# EAGLE design Own_FeatherWing_Doubler_1X2_v1.0_Final_AR (EAGLE 9.6.2)
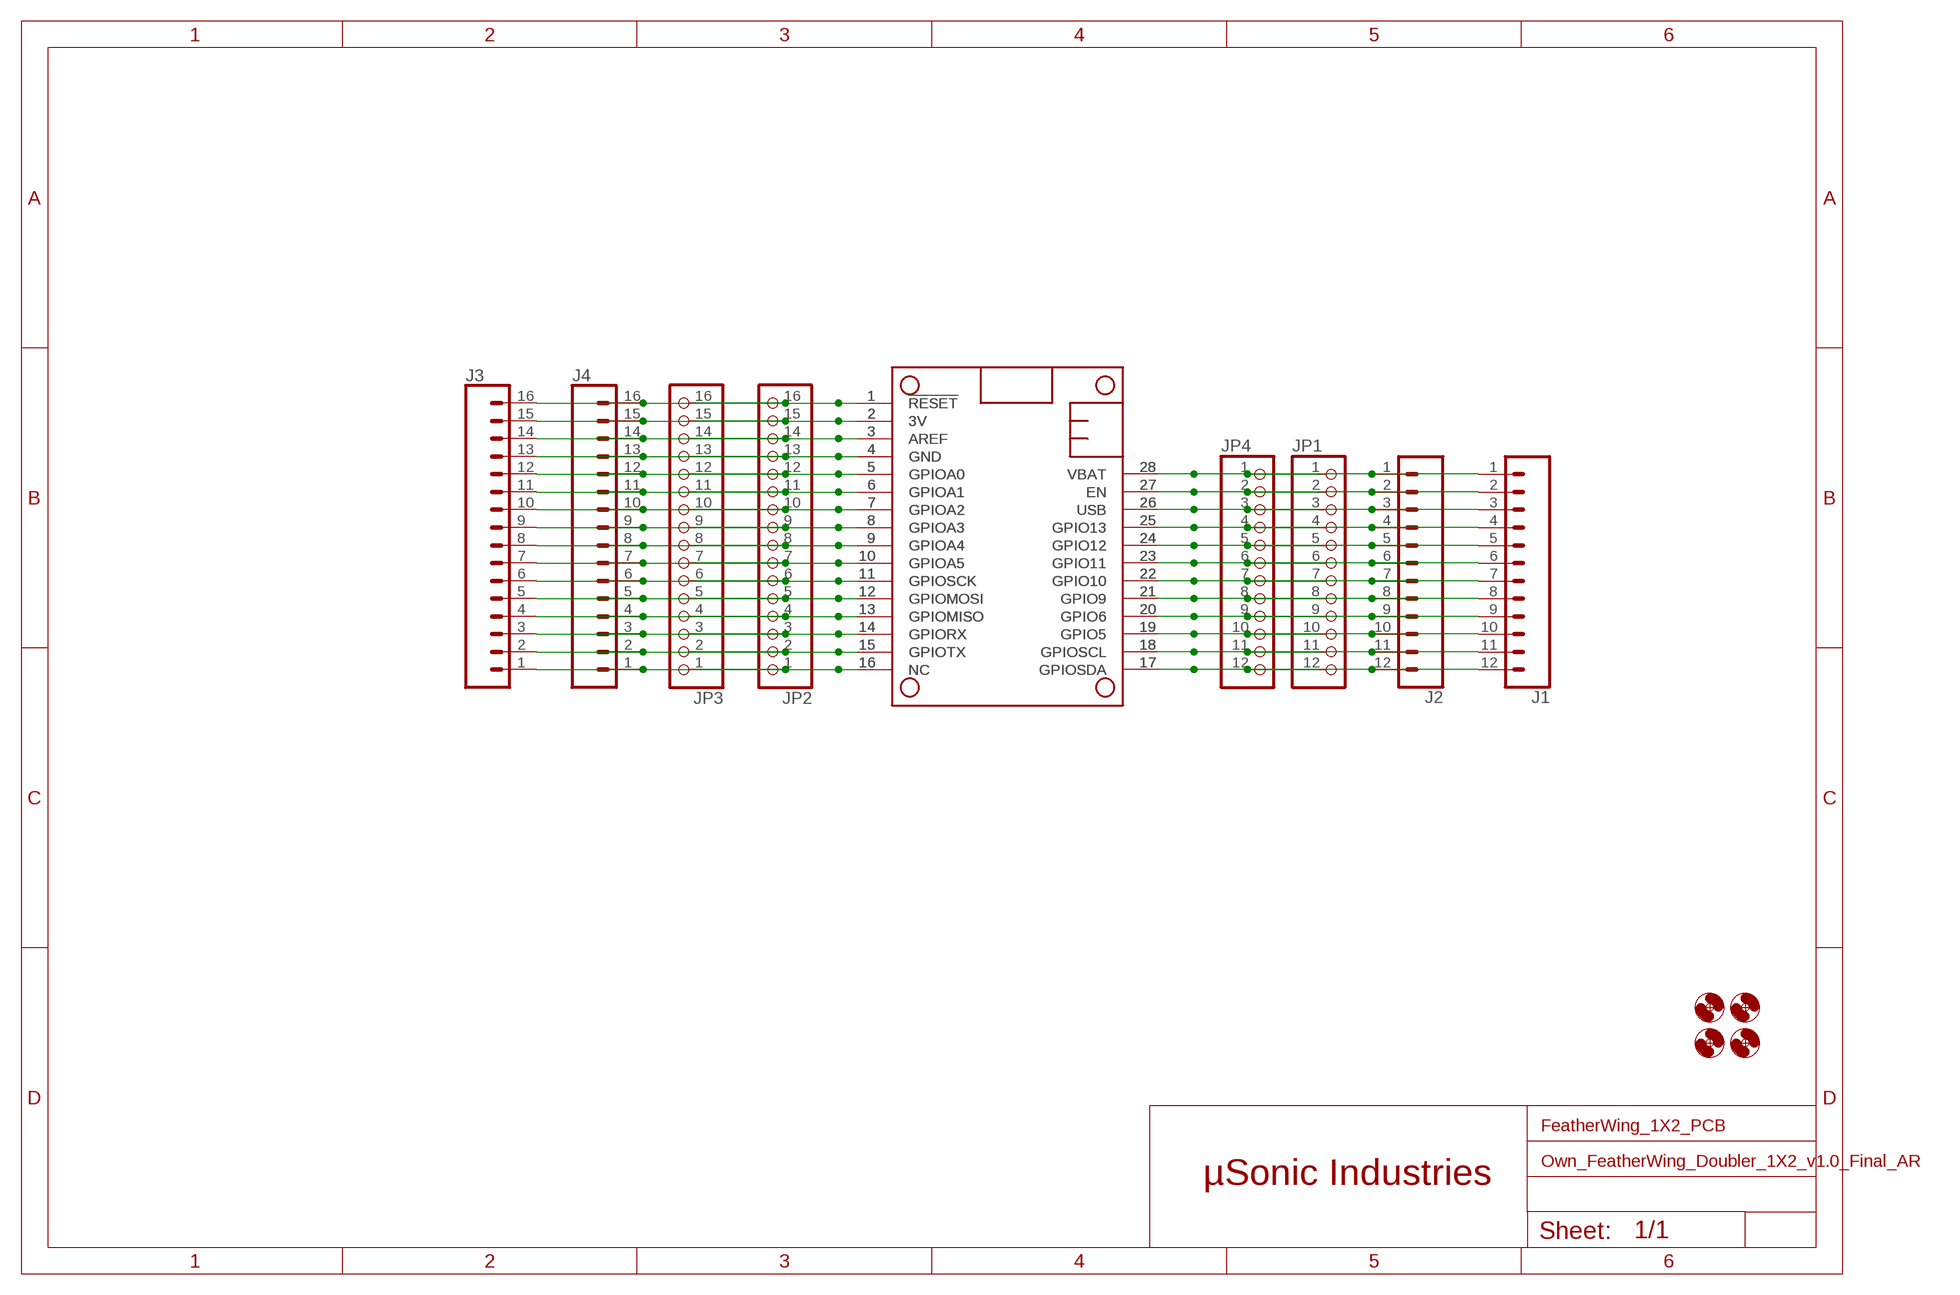
[diagram p0: schematic, sheet 1]

## Parts
J1  CONN_12NO_SILK  [1X12_NO_SILK]
J2  CONN_12NO_SILK  [1X12_NO_SILK]
J3  CONN_161X16_NO_SILK  [1X16_NO_SILK]
J4  CONN_161X16_NO_SILK  [1X16_NO_SILK]
JP1  HEADER-1X1276MIL  [1X12_ROUND_76MIL]
JP2  HEADER-1X16_76MIL  [1X16_ROUND_76MIL]
JP3  HEADER-1X16_76MIL  [1X16_ROUND_76MIL]
JP4  HEADER-1X1276MIL  [1X12_ROUND_76MIL]
MS1  FEATHERWING_NODIM  [FEATHERWING_DIM]
MS2  FEATHERWING_NODIM  [FEATHERWING_DIM]
U$2  MOUNTHOLEBIG  [OWN_MOUNTHOLE_BIGAREA]
U$3  MOUNTHOLEBIG  [OWN_MOUNTHOLE_BIGAREA]
U$4  MOUNTHOLEBIG  [OWN_MOUNTHOLE_BIGAREA]
U$5  MOUNTHOLEBIG  [OWN_MOUNTHOLE_BIGAREA]

## Nets
3V: J3.15 J4.15 JP2.15 JP3.15 MS1.2(3V) MS2.2(3V)
GND: J3.13 J4.13 JP2.13 JP3.13 MS1.4(GND) MS2.4(GND)
N$1: J1.2 J2.2 JP1.2 JP4.2 MS1.27(EN) MS2.27(EN)
N$2: J3.1 J4.1 JP2.1 JP3.1 MS1.16(NC) MS2.16(NC)
N$3: J1.4 J2.4 JP1.4 JP4.4 MS1.25(GPIO13) MS2.25(GPIO13)
N$4: J3.2 J4.2 JP2.2 JP3.2 MS1.15(GPIOTX) MS2.15(GPIOTX)
N$5: J1.5 J2.5 JP1.5 JP4.5 MS1.24(GPIO12) MS2.24(GPIO12)
N$6: J3.3 J4.3 JP2.3 JP3.3 MS1.14(GPIORX) MS2.14(GPIORX)
N$7: J3.4 J4.4 JP2.4 JP3.4 MS1.13(GPIOMISO) MS2.13(GPIOMISO)
N$8: J3.5 J4.5 JP2.5 JP3.5 MS1.12(GPIOMOSI) MS2.12(GPIOMOSI)
N$9: J3.6 J4.6 JP2.6 JP3.6 MS1.11(GPIOSCK) MS2.11(GPIOSCK)
N$10: J3.7 J4.7 JP2.7 JP3.7 MS1.10(GPIOA5) MS2.10(GPIOA5)
N$11: J3.8 J4.8 JP2.8 JP3.8 MS1.9(GPIOA4) MS2.9(GPIOA4)
N$12: J3.9 J4.9 JP2.9 JP3.9 MS1.8(GPIOA3) MS2.8(GPIOA3)
N$13: J3.10 J4.10 JP2.10 JP3.10 MS1.7(GPIOA2) MS2.7(GPIOA2)
N$14: J3.11 J4.11 JP2.11 JP3.11 MS1.6(GPIOA1) MS2.6(GPIOA1)
N$15: J3.12 J4.12 JP2.12 JP3.12 MS1.5(GPIOA0) MS2.5(GPIOA0)
N$17: J3.14 J4.14 JP2.14 JP3.14 MS1.3(AREF) MS2.3(AREF)
N$18: J3.16 J4.16 JP2.16 JP3.16 MS1.1(!RESET) MS2.1(!RESET)
N$19: J1.6 J2.6 JP1.6 JP4.6 MS1.23(GPIO11) MS2.23(GPIO11)
N$20: J1.7 J2.7 JP1.7 JP4.7 MS1.22(GPIO10) MS2.22(GPIO10)
N$21: J1.8 J2.8 JP1.8 JP4.8 MS1.21(GPIO9) MS2.21(GPIO9)
N$22: J1.9 J2.9 JP1.9 JP4.9 MS1.20(GPIO6) MS2.20(GPIO6)
N$23: J1.10 J2.10 JP1.10 JP4.10 MS1.19(GPIO5) MS2.19(GPIO5)
N$24: J1.11 J2.11 JP1.11 JP4.11 MS1.18(GPIOSCL) MS2.18(GPIOSCL)
N$25: J1.12 J2.12 JP1.12 JP4.12 MS1.17(GPIOSDA) MS2.17(GPIOSDA)
USB: J1.3 J2.3 JP1.3 JP4.3 MS1.26(USB) MS2.26(USB)
VBAT: J1.1 J2.1 JP1.1 JP4.1 MS1.28(VBAT) MS2.28(VBAT)

## Notes on the sheet
- FeatherWing_1X2_PCB
- µSonic Industries

## Library data of the parts
J1 J2 = SparkFun-Connectors:CONN_12: Multi connection point. Often used as Generic Header-pin footprint for 0.1 inch spaced/style header connections On any of the 0.1 inch spaced packages, you can populate with these: Break Away Headers - Straight <https://www.sparkfun.com/products/116> (PRT-00116) Break Away Male Headers - Right Angle <https://www.sparkfun.com/products/553> (PRT-00553) Female Headers <https://www.sparkfun.com/products/115> (PRT-00115) Break Away Headers - Machine Pin <https://www.sparkfun.com/products/117> (PRT-00117) Break Away Female Headers - Swiss Machine Pin <https://www.sparkfun.com/products/743> (PRT-00743) For SCREWTERMINALS and SPRING TERMINALS visit here: Screw Terimnals on SparkFun.com <https://www.sparkfun.com/search/results?term=Screw+Terminals> (5mm/3.5mm/2.54mm spacing) This device is also useful as a general connection point to wire up your design to another part of your project. Our various solder wires solder well into these plated through hole pads. Hook-Up Wire - Assortment (Stranded, 22 AWG) <https://www.sparkfun.com/products/11375> (PRT-11375) Hook-Up Wire - Assortment (Solid Core, 22 AWG) <https://www.sparkfun.com/products/11367> (PRT-11367) View the entire wire category on our website here <https://www.sparkfun.com/categories/141> Special notes: Molex polarized connector foot print use with SKU : PRT-08231 with associated crimp pins and housings. 1MM SMD Version SKU: PRT-10208 NOTES ON THE VARIANTS LOCK and LOCK_LONGPADS... This footprint was designed to help hold the alignment of a through-hole component (i.e. 6-pin header) while soldering it into place. You may notice that each hole has been shifted either up or down by 0.005 of an inch from it's more standard position (which is a perfectly straight line). This slight alteration caused the pins (the squares in the middle) to touch the edges of the holes. Because they are alternating, it causes a "brace" to hold the component in place. 0.005 has proven to be the perfect amount of "off-center" position when using our standard breakaway headers. Although looks a little odd when you look at the bare footprint, once you have a header in there, the alteration is very hard to notice. Also,if you push a header all the way into place, it is covered up entirely on the bottom side.
J3 J4 = SparkFun-Connectors:CONN_16: Multi connection point. Often used as Generic Header-pin footprint for 0.1 inch spaced/style header connections On any of the 0.1 inch spaced packages, you can populate with these: Break Away Headers - Straight <https://www.sparkfun.com/products/116> (PRT-00116) Break Away Male Headers - Right Angle <https://www.sparkfun.com/products/553> (PRT-00553) Female Headers <https://www.sparkfun.com/products/115> (PRT-00115) Break Away Headers - Machine Pin <https://www.sparkfun.com/products/117> (PRT-00117) Break Away Female Headers - Swiss Machine Pin <https://www.sparkfun.com/products/743> (PRT-00743) For SCREWTERMINALS and SPRING TERMINALS visit here: Screw Terimnals on SparkFun.com <https://www.sparkfun.com/search/results?term=Screw+Terminals> (5mm/3.5mm/2.54mm spacing) This device is also useful as a general connection point to wire up your design to another part of your project. Our various solder wires solder well into these plated through hole pads. Hook-Up Wire - Assortment (Stranded, 22 AWG) <https://www.sparkfun.com/products/11375> (PRT-11375) Hook-Up Wire - Assortment (Solid Core, 22 AWG) <https://www.sparkfun.com/products/11367> (PRT-11367) View the entire wire category on our website here <https://www.sparkfun.com/categories/141> Special notes: Molex polarized connector foot print use with SKU : PRT-08231 with associated crimp pins and housings. 1MM SMD Version SKU: PRT-10208 NOTES ON THE VARIANTS LOCK and LOCK_LONGPADS... This footprint was designed to help hold the alignment of a through-hole component (i.e. 6-pin header) while soldering it into place. You may notice that each hole has been shifted either up or down by 0.005 of an inch from it's more standard position (which is a perfectly straight line). This slight alteration caused the pins (the squares in the middle) to touch the edges of the holes. Because they are alternating, it causes a "brace" to hold the component in place. 0.005 has proven to be the perfect amount of "off-center" position when using our standard breakaway headers. Although looks a little odd when you look at the bare footprint, once you have a header in there, the alteration is very hard to notice. Also,if you push a header all the way into place, it is covered up entirely on the bottom side.
JP1 JP4 = microbuilder:HEADER-1X12
JP2 JP3 = microbuilder:HEADER-1X16: PIN HEADER
MS1 MS2 = microbuilder:FEATHERWING
U$2-U$5 = adafruit2:MOUNTHOLE

## Net classes
0 default: width 0.25 mm

## Board
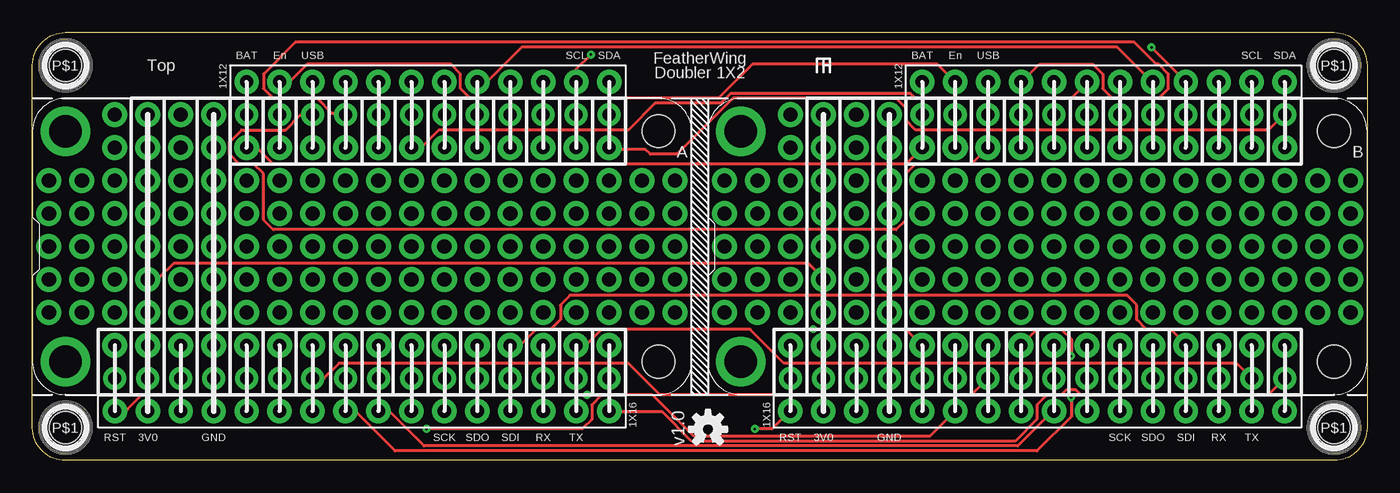
[diagram p1: board, top side]
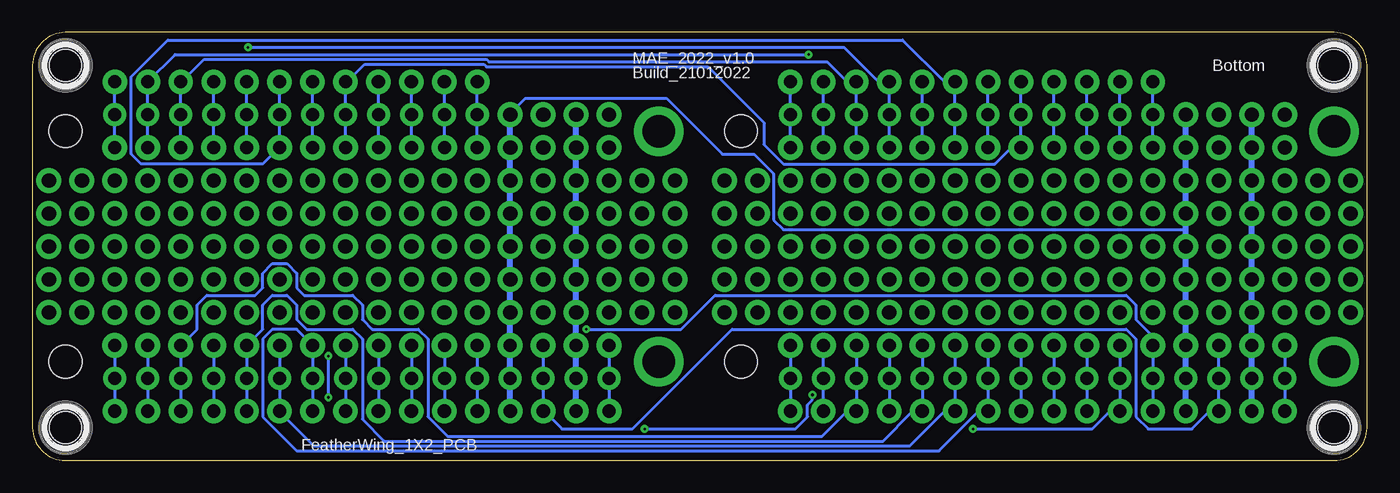
[diagram p2: board, bottom side, seen from below]

Size 102.87 x 33.02 mm. Coordinates in mm from the lower left corner, seen from the top.
Outline: 2.54,33.02 100.33,33.02 arc-90 102.87,30.48 102.87,2.54 arc-90 100.33,0 2.54,0 arc-90 0,2.54 0,30.48 arc-90 2.54,33.02
Copper layers (1*16): Top 0.035mm / dielectric 1.5mm / Bottom 0.035mm
Design rules "aisler_2_layer_complex": minimum track width 0.125mm, minimum drill 0.2mm, track to track 0.125mm, track to pad 0.125mm, pad to pad 0.125mm, via to via 0.125mm, smd to smd 0.125mm, copper to edge 0.3mm, drill to drill 0.25mm, minimum pad ring 0.2mm, minimum via ring 0.2mm, stop-mask expansion 0mil, vias tented up to drill 0mil, thermal gap 10mil

### Footprints (pad centres in the part's own frame; a part is rotated, then mirrored left to right if it is on the bottom)
1X12_NO_SILK = drill 1.016 pad 1.88: 1 0,0; 2 2.54,0; 3 5.08,0; 4 7.62,0; 5 10.16,0; 6 12.7,0; 7 15.24,0; 8 17.78,0; 9 20.32,0; 10 22.86,0; 11 25.4,0; 12 27.94,0
1X16_NO_SILK = drill 1.016 pad 1.88: 1 0,0; 2 2.54,0; 3 5.08,0; 4 7.62,0; 5 10.16,0; 6 12.7,0; 7 15.24,0; 8 17.78,0; 9 20.32,0; 10 22.86,0; 11 25.4,0; 12 27.94,0; 13 30.48,0; 14 33.02,0; 15 35.56,0; 16 38.1,0
1X12_ROUND_76MIL = drill 1 pad 1.93: 1 -13.97,0; 2 -11.43,0; 3 -8.89,0; 4 -6.35,0; 5 -3.81,0; 6 -1.27,0; 7 1.27,0; 8 3.81,0; 9 6.35,0; 10 8.89,0; 11 11.43,0; 12 13.97,0
1X16_ROUND_76MIL = drill 1 pad 1.93: 1 -19.05,0; 2 -16.51,0; 3 -13.97,0; 4 -11.43,0; 5 -8.89,0; 6 -6.35,0; 7 -3.81,0; 8 -1.27,0; 9 1.27,0; 10 3.81,0; 11 6.35,0; 12 8.89,0; 13 11.43,0; 14 13.97,0; 15 16.51,0; 16 19.05,0
FEATHERWING_DIM = drill 1 pad 1.778: 1 6.35,1.27; 2 8.89,1.27; 3 11.43,1.27; 4 13.97,1.27; 5 16.51,1.27; 6 19.05,1.27; 7 21.59,1.27; 8 24.13,1.27; 9 26.67,1.27; 10 29.21,1.27; 11 31.75,1.27; 12 34.29,1.27; 13 36.83,1.27; 14 39.37,1.27; 15 41.91,1.27; 16 44.45,1.27; 17 44.45,21.59; 18 41.91,21.59; 19 39.37,21.59; 20 36.83,21.59; 21 34.29,21.59; 22 31.75,21.59; 23 29.21,21.59; 24 26.67,21.59; 25 24.13,21.59; 26 21.59,21.59; 27 19.05,21.59; 28 16.51,21.59 | drill 2.5 pad 3.81: P$1 2.54,20.32; P$2 2.54,2.54 | hole 2.54: 48.26,20.32; 48.26,2.54
OWN_MOUNTHOLE_BIGAREA = hole 2.5: 0,0

### Placement (x,y rotation side)
J1  16.51,29.21 0 top
J2  68.58,29.21 0 top
J3  96.52,3.81 180 top
J4  44.45,3.81 180 top
JP1  30.48,24.13 0 top
JP2  77.47,8.89 180 top
JP3  25.4,8.89 180 top
JP4  82.55,24.13 0 top
MS1  0,5.08 0 top
MS2  52.07,5.08 0 top
U$2  2.54,30.48 0 top
U$3  100.33,30.48 0 top
U$4  2.54,2.54 0 top
U$5  100.33,2.54 0 top
U$6  [OSHW-LOGO-S]  52.07,2.41 0 top

### Tracks (layer width: path | path; a pad name or v marks a point on that pad's centre or on a via)
3V  (via drill 1.1 pad 1.93)
  Top 0.25: v8.89,13.97 9,14.06 9.75,14.06 10.88,15.19 59.81,15.19 60.94,14.06 v60.96,13.97
  Bottom 0.25: v8.89,11.43 9,11.44 v8.89,11.44 | 8.89,14.06 9,14.06 v8.89,13.97 | v8.89,16.5 9,16.5 v8.89,16.51 | v8.89,19.05 9,19.12 8.89,19.12 | v8.89,21.59 9,21.56 8.89,21.56 | v8.89,24.13 9,24.19 8.89,24.19 | MS1.2 9,6.38 8.89,6.38 | JP3.15 9,8.81 8.89,8.81 | v60.96,11.43 60.94,11.44 v60.96,11.44 | 60.96,14.06 60.94,14.06 v60.96,13.97 | v60.96,16.5 60.94,16.5 v60.96,16.51 | v60.96,19.05 60.94,19.12 60.96,19.12 | v60.96,21.59 60.94,21.56 60.96,21.56 | v60.96,24.13 60.94,24.19 60.96,24.19 | MS2.2 60.94,6.38 60.96,6.38 | JP2.15 60.94,8.81 60.96,8.81
  Bottom 0.45: J3.15 MS2.2 60.96,6.38 60.96,8.81 JP2.15 v60.96,11.43 v60.96,11.44 v60.96,13.97 60.96,14.06 v60.96,16.5 v60.96,16.51 v60.96,19.05 60.96,19.12 60.96,21.56 v60.96,21.59 v60.96,24.13 60.96,24.19 v60.96,26.67 | J4.15 MS1.2 8.89,6.38 8.89,8.81 JP3.15 v8.89,11.43 v8.89,11.44 v8.89,13.97 8.89,14.06 v8.89,16.5 v8.89,16.51 v8.89,19.05 8.89,19.12 8.89,21.56 v8.89,21.59 v8.89,24.13 8.89,24.19 v8.89,26.67
GND  (via drill 1.1 pad 1.93)
  Bottom 0.25: v13.97,11.43 14.06,11.44 v13.97,11.44 | 13.97,14.06 14.06,14.06 v13.97,13.97 | v13.97,16.5 14.06,16.5 v13.97,16.51 | v13.97,19.05 14.06,19.12 13.97,19.12 | v13.97,21.59 14.06,21.56 13.97,21.56 | v13.97,24.13 14.06,24.19 13.97,24.19 | MS1.4 14.06,6.38 13.97,6.38 | JP3.13 14.06,8.81 13.97,8.81 | v66.04,11.43 66.19,11.44 v66.04,11.44 | 66.04,14.06 66.19,14.06 v66.04,13.97 | v66.04,16.5 66.19,16.5 v66.04,16.51 | v66.04,19.05 66.19,19.12 66.04,19.12 | v66.04,21.59 66.19,21.56 66.04,21.56 | v66.04,24.13 66.19,24.19 66.04,24.19 | MS2.4 66,6.38 66.04,6.38 | JP2.13 66.19,8.81 66.04,8.81 | 13.97,17.81 45,17.81 45.75,18.56 45.75,22.12 47.25,23.62 49.69,23.62 54,27.94 64.88,27.94 66,26.81 v66.04,26.67
  Bottom 0.45: J3.13 MS2.4 66.04,6.38 66.04,8.81 JP2.13 v66.04,11.43 v66.04,11.44 v66.04,13.97 66.04,14.06 v66.04,16.5 v66.04,16.51 v66.04,19.05 66.04,19.12 66.04,21.56 v66.04,21.59 v66.04,24.13 66.04,24.19 v66.04,26.67 | J4.13 MS1.4 13.97,6.38 13.97,8.81 JP3.13 v13.97,11.43 v13.97,11.44 v13.97,13.97 13.97,14.06 v13.97,16.5 v13.97,16.51 13.97,17.81 v13.97,19.05 13.97,19.12 13.97,21.56 v13.97,21.59 v13.97,24.13 13.97,24.19 v13.97,26.67
N$1
  Top 0.25: J1.2 19.12,29.25 19.88,29.25 21.19,30.56 32.25,30.56 33,29.81 33,28.69 33.75,27.94 52.88,27.94 55.5,30.56 69.75,30.56 71.06,29.25 J2.2
  Bottom 0.25: JP1.2 MS1.27 | MS1.27 19.05,26.81 | 19.05,26.81 J1.2 | JP4.2 MS2.27 | MS2.27 71.12,26.81 | 71.12,26.81 J2.2 | MS1.27 19.12,26.81 19.05,26.81 | MS2.27 71.06,26.81 71.12,26.81
N$2
  Top 0.25: J4.1 44.62,3.75 48.56,3.75 50.81,1.5 75.75,1.5 77.44,3.19 77.44,4.31 78.19,5.06 79.31,5.06 79.69,5.44 80.44,5.44 80.81,5.06 95.25,5.06 96.38,6.19 MS2.16
  Bottom 0.25: JP3.1 44.45,6.38 | 44.45,6.38 MS1.16 | MS1.16 J4.1 | JP2.1 96.52,6.38 | 96.52,6.38 MS2.16 | MS2.16 J3.1 | MS1.16 44.44,6.38 44.45,6.38 | 96.52,6.38 96.56,6.38 MS2.16
N$3
  Top 0.25: MS1.25 24,26.81 23.06,26.81 21.94,27.94 18.56,27.94 17.81,28.69 17.81,29.81 20.25,32.25 84.94,32.25 86.62,30.56 86.81,30.56 87.56,29.81 87.56,28.69 86.81,27.94 83.25,27.94 82.5,28.69 82.5,29.81 81.75,30.56 77.62,30.56 76.31,29.25 J2.4
  Bottom 0.25: JP1.4 MS1.25 | MS1.25 24.13,26.81 | 24.13,26.81 J1.4 | JP4.4 MS2.25 | MS2.25 76.2,26.81 | 76.2,26.81 J2.4 | MS1.25 24.19,26.81 24.13,26.81 | MS2.25 76.31,26.81 76.2,26.81
N$4
  Top 0.25: JP3.2 42,9 42.75,9 43.88,10.12 55.31,10.12 57.94,7.5 92.81,7.5 93.94,6.38 MS2.15
  Bottom 0.25: J4.2 MS1.15 | MS1.15 41.91,6.38 | 41.91,6.38 JP3.2 | JP2.2 93.98,6.38 | 93.98,6.38 MS2.15 | MS2.15 J3.2 | MS1.15 42,6.38 41.91,6.38 | 93.98,6.38 93.94,6.38 MS2.15
N$5
  Bottom 0.25: MS1.24 JP1.5 26.81,24 27.56,24 28.69,22.88 45,22.88 46.5,24.38 46.5,26.06 50.81,30.38 67.88,30.38 68.06,30.56 77.25,30.56 78.56,29.25 J2.5 78.74,26.81 | MS1.24 26.67,26.81 | 26.67,26.81 J1.5 | JP4.5 MS2.24 | MS2.24 78.74,26.81 | MS1.24 26.62,26.81 26.67,26.81 | MS2.24 78.75,26.81 78.74,26.81
N$6
  Bottom 0.25: JP3.3 39.37,6.38 | 39.37,6.38 MS1.14 | MS1.14 J4.3 39.38,3.75 40.12,3.75 42,1.88 70.88,1.88 72.38,3.38 72.38,9.38 73.12,10.12 76.69,10.12 77.44,10.88 77.44,12 78.19,12.75 81.94,12.75 82.5,13.31 82.5,14.44 83.25,15.19 84.38,15.19 85.12,14.44 85.12,13.31 85.69,12.75 89.44,12.75 90.19,12 90.19,10.12 91.31,9 JP2.3 91.44,6.38 | 91.44,6.38 MS2.14 | MS2.14 J3.3 | MS1.14 39.38,6.38 39.37,6.38 | MS2.14 91.5,6.38 91.44,6.38
N$7
  Top 0.25: JP3.4 36.94,9 37.69,9 38.81,10.12 39.94,10.12 40.69,10.88 40.69,12 41.44,12.75 84.38,12.75 85.12,12 85.12,10.88 85.88,10.12 87.75,10.12 88.88,9 JP2.4
  Bottom 0.25: JP3.4 36.83,6.38 | 36.83,6.38 MS1.13 | MS1.13 J4.4 | JP2.4 88.9,6.38 | 88.9,6.38 MS2.13 | MS2.13 J3.4 | MS1.13 36.94,6.38 36.83,6.38 | MS2.13 88.88,6.38 88.9,6.38
N$8
  Bottom 0.25: JP3.5 34.29,6.38 | 34.29,6.38 MS1.12 | MS1.12 J4.5 34.31,3.75 35.06,3.75 37.31,1.5 75.75,1.5 77.44,3.19 77.44,9.38 78.19,10.12 81.75,10.12 82.5,10.88 82.5,12 83.25,12.75 84.38,12.75 85.12,12 85.12,10.12 JP2.5 86.36,6.38 | 86.36,6.38 MS2.12 | MS2.12 J3.5 | MS1.12 34.31,6.38 34.29,6.38 | MS2.12 86.44,6.38 86.36,6.38
N$9
  Bottom 0.25: JP3.6 31.75,6.38 | 31.75,6.38 MS1.11 | MS1.11 J4.6 31.88,3.75 32.62,3.75 35.25,1.12 81.19,1.12 83.81,3.75 J3.6 MS2.11 | JP2.6 83.82,6.38 | 83.82,6.38 MS2.11 | MS1.11 31.69,6.38 31.75,6.38 | MS2.11 83.81,6.38 83.82,6.38
N$10
  Bottom 0.25: JP3.7 29.21,6.38 | 29.21,6.38 MS1.10 | MS1.10 J4.7 29.25,3.75 30,3.75 33,0.75 82.5,0.75 85.12,3.38 85.12,9.38 84.38,10.12 82.5,10.12 81.38,9 JP2.7 81.28,6.38 | 81.28,6.38 MS2.10 | MS2.10 J3.7 | MS1.10 29.25,6.38 29.21,6.38 | MS2.10 81.38,6.38 81.28,6.38
N$11
  Top 0.25: J4.8 26.81,3.75 27.56,3.75 30.19,1.12 75.94,1.12 78.56,3.75 J3.8
  Bottom 0.25: JP3.8 26.67,6.38 | 26.67,6.38 MS1.9 | MS1.9 J4.8 | JP2.8 78.74,6.38 | 78.74,6.38 MS2.9 | MS2.9 J3.8 | MS1.9 26.62,6.38 26.67,6.38 | MS2.9 78.75,6.38 78.74,6.38
N$12  (via drill 0.2)
  Top 0.25: v80.06,4.88 80.06,3.38 77.44,0.75 27.94,0.75 24.94,3.75 24.19,3.75 J4.9 | v80.06,8.06 80.06,9.38 79.31,10.12 77.44,10.12 76.31,9 JP2.9
  Bottom 0.25: JP3.9 24.13,6.38 | 24.13,6.38 MS1.8 | MS1.8 J4.9 | JP2.9 76.2,6.38 | 76.2,6.38 MS2.8 | MS2.8 J3.9 | MS1.8 24.19,6.38 24.13,6.38 | v80.06,8.06 v80.06,4.88 | MS2.8 76.31,6.38 76.2,6.38
N$13
  Top 0.25: MS1.7 21.75,6.38 22.5,6.38 23.62,7.5 45.94,7.5 48.38,5.06 72.38,5.06 73.5,6.19 MS2.7
  Bottom 0.25: JP3.10 21.59,6.38 | 21.59,6.38 MS1.7 | MS1.7 J4.10 | JP2.10 73.66,6.38 | 73.66,6.38 MS2.7 | MS2.7 J3.10 | MS1.7 21.56,6.38 21.59,6.38 | 73.66,6.38 73.69,6.38 MS2.7
N$14  (via drill 0.2)
  Top 0.25: v30.38,2.44 42.38,2.44 43.12,3.19 43.12,4.31 43.88,5.06 47.81,5.06 51,1.88 69.19,1.88 71.06,3.75 J3.11
  Bottom 0.25: JP3.11 19.05,6.38 | 19.05,6.38 MS1.6 | MS1.6 J4.11 19.12,3.75 19.88,3.75 21.19,2.44 v30.38,2.44 | JP2.11 71.12,6.38 | 71.12,6.38 MS2.6 | MS2.6 J3.11 | MS1.6 19.12,6.38 19.05,6.38 | MS2.6 71.06,6.38 71.12,6.38
N$15  (via drill 0.2)
  Top 0.25: v60.19,10.12 67.31,10.12 68.44,9 JP2.12
  Bottom 0.25: 16.51,6.38 JP3.12 16.69,9 16.69,9.75 17.81,10.88 17.81,12 18.56,12.75 50.25,12.75 52.88,10.12 v60.19,10.12 | 16.51,6.38 MS1.5 | MS1.5 J4.12 | JP2.12 68.58,6.38 | 68.58,6.38 MS2.5 | MS2.5 J3.12 | MS1.5 16.5,6.38 16.51,6.38 | MS2.5 68.62,6.38 68.58,6.38
N$16  (via drill 1.1 pad 1.93)
  other vias: 96.52,11.43
N$17
  Bottom 0.25: JP2.14 63.5,6.38 | 63.5,6.38 MS2.3 | MS2.3 J3.14 63.38,3.75 62.06,2.44 56.62,2.44 48.94,10.12 18.56,10.12 17.81,9.38 17.81,3.38 16.88,2.44 13.5,2.44 12.19,3.75 11.44,3.75 J4.14 MS1.3 | MS1.3 11.43,6.38 | 11.43,6.38 JP3.14 | MS1.3 11.44,6.38 11.43,6.38 | MS2.3 63.56,6.38 63.5,6.38
N$18  (via drill 0.2)
  Top 0.25: v42.75,5.06 8.44,5.06 7.31,3.94 6.38,3.94 J4.16 | v55.69,2.44 57,2.44 58.31,3.75 J3.16
  Bottom 0.25: JP3.16 6.35,6.38 | 6.35,6.38 MS1.1 | MS1.1 J4.16 | JP2.16 58.42,6.38 | 58.42,6.38 MS2.1 | MS2.1 J3.16 | MS1.1 6.38,6.38 6.35,6.38 | v42.75,5.06 42.75,4.69 43.12,4.31 43.12,3.38 44.06,2.44 v55.69,2.44 | MS2.1 58.5,6.38 58.42,6.38
N$19
  Top 0.25: JP1.6 29.25,24.19 30,24.19 31.31,25.5 45.94,25.5 48,27.56 53.06,27.56 53.81,28.31 67.69,28.31 68.06,27.94 80.06,27.94 81.19,29.06 J2.6
  Bottom 0.25: JP1.6 MS1.23 | MS1.23 29.21,26.81 | 29.21,26.81 J1.6 | JP4.6 MS2.23 | MS2.23 81.28,26.81 | 81.28,26.81 J2.6 | MS1.23 29.25,26.81 29.21,26.81 | MS2.23 81.38,26.81 81.28,26.81
N$20
  Bottom 0.25: JP1.7 MS1.22 | MS1.22 31.75,26.81 | 31.75,26.81 J1.7 31.88,29.25 32.62,29.25 35.81,32.44 92.44,32.44 95.25,29.62 95.25,23.62 94.5,22.88 85.12,22.88 84,24 JP4.7 MS2.22 | MS2.22 83.82,26.81 | 83.82,26.81 J2.7 | MS1.22 31.69,26.81 31.75,26.81 | MS2.22 83.81,26.81 83.82,26.81
N$21
  Top 0.25: J1.8 34.31,29.25 35.06,29.25 37.69,31.88 83.62,31.88 86.25,29.25 J2.8
  Bottom 0.25: JP1.8 MS1.21 | MS1.21 34.29,26.81 | 34.29,26.81 J1.8 | JP4.8 MS2.21 | MS2.21 86.36,26.81 | 86.36,26.81 J2.8 | MS1.21 34.31,26.81 34.29,26.81 | MS2.21 86.44,26.81 86.36,26.81
N$22  (via drill 0.2)
  Top 0.25: v86.25,31.88 88.88,29.25 J2.9
  Bottom 0.25: JP1.9 MS1.20 | MS1.20 36.83,26.81 | 36.83,26.81 J1.9 36.94,29.25 37.69,29.25 40.31,31.88 v86.25,31.88 | JP4.9 MS2.20 | MS2.20 88.9,26.81 | 88.9,26.81 J2.9 | MS1.20 36.94,26.81 36.83,26.81 | MS2.20 88.88,26.81 88.9,26.81
N$23
  Bottom 0.25: JP1.10 MS1.19 | MS1.19 39.37,26.81 | 39.37,26.81 J1.10 39.38,29.25 40.12,29.25 41.62,30.75 67.69,30.75 67.88,30.94 89.62,30.94 91.31,29.25 J2.10 91.44,26.81 | JP4.10 MS2.19 | MS2.19 91.44,26.81 | MS1.19 39.38,26.81 39.37,26.81 | MS2.19 91.5,26.81 91.44,26.81
N$24  (via drill 0.2)
  Top 0.25: J1.11 41.91,30.18 v43.05,31.31
  Bottom 0.25: JP1.11 MS1.18 | MS1.18 41.91,26.81 | 41.91,26.81 J1.11 | JP4.11 MS2.18 | MS2.18 93.98,26.81 | 93.98,26.81 J2.11 93.94,29.25 91.88,31.31 v43.05,31.31 | MS1.18 42,26.81 41.91,26.81 | MS2.18 93.94,26.81 93.98,26.81
N$25
  Top 0.25: JP1.12 44.62,24 47.25,24 47.62,23.62 49.69,23.62 54,27.94 66.56,27.94 67.31,27.19 67.31,26.25 68.06,25.5 95.25,25.5 96.38,26.62 MS2.17
  Bottom 0.25: JP1.12 MS1.17 | MS1.17 44.45,26.81 | 44.45,26.81 J1.12 | JP4.12 96.52,26.62 | 96.52,26.62 MS2.17 | MS2.17 J2.12 | MS1.17 44.44,26.81 44.45,26.81 | 96.52,26.62 96.56,26.62 MS2.17
N$26  (via drill 1.1 pad 1.93)
  other vias: 6.35,11.43
N$27  (via drill 1.1 pad 1.93)
  other vias: 96.52,13.97
N$28  (via drill 1.1 pad 1.93)
  other vias: 11.43,11.43
N$29  (via drill 1.1 pad 1.93)
  other vias: 96.52,16.51
N$30  (via drill 1.1 pad 1.93)
  other vias: 96.52,19.05
N$31  (via drill 1.1 pad 1.93)
  other vias: 11.43,13.97
N$32  (via drill 1.1 pad 1.93)
  other vias: 96.52,21.59
N$33  (via drill 1.1 pad 1.93)
  other vias: 6.35,13.97
N$34  (via drill 1.1 pad 1.93)
  other vias: 6.35,16.51
N$35  (via drill 1.1 pad 1.93)
  other vias: 93.98,21.59
N$36  (via drill 1.1 pad 1.93)
  other vias: 3.81,11.43
N$37  (via drill 1.1 pad 1.93)
  other vias: 1.27,11.43
N$38  (via drill 1.1 pad 1.93)
  other vias: 1.27,13.97
N$39  (via drill 1.1 pad 1.93)
  other vias: 3.81,13.97
N$40  (via drill 1.1 pad 1.93)
  other vias: 3.81,16.51
N$41  (via drill 1.1 pad 1.93)
  other vias: 1.27,16.51
N$42  (via drill 1.1 pad 1.93)
  other vias: 1.27,19.05
N$43  (via drill 1.1 pad 1.93)
  other vias: 3.81,19.05
N$44  (via drill 1.1 pad 1.93)
  other vias: 6.35,19.05
N$45  (via drill 1.1 pad 1.93)
  other vias: 93.98,19.05
N$46  (via drill 1.1 pad 1.93)
  other vias: 11.43,19.05
N$47  (via drill 1.1 pad 1.93)
  other vias: 11.43,16.51
N$48  (via drill 1.1 pad 1.93)
  other vias: 93.98,16.51
N$49  (via drill 1.1 pad 1.93)
  other vias: 93.98,13.97
N$50  (via drill 1.1 pad 1.93)
  other vias: 1.27,21.59
N$51  (via drill 1.1 pad 1.93)
  other vias: 3.81,21.59
N$52  (via drill 1.1 pad 1.93)
  other vias: 6.35,21.59
N$53  (via drill 1.1 pad 1.93)
  other vias: 93.98,11.43
N$54  (via drill 1.1 pad 1.93)
  other vias: 11.43,21.59
N$55  (via drill 1.1 pad 1.93)
  other vias: 99.06,11.43
N$56  (via drill 1.1 pad 1.93)
  other vias: 99.06,13.97
N$57  (via drill 1.1 pad 1.93)
  other vias: 99.06,16.51
N$58  (via drill 1.1 pad 1.93)
  other vias: 11.43,26.67
N$59  (via drill 1.1 pad 1.93)
  other vias: 11.43,24.13
N$60  (via drill 1.1 pad 1.93)
  other vias: 99.06,19.05
N$61  (via drill 1.1 pad 1.93)
  other vias: 99.06,21.59
N$62  (via drill 1.1 pad 1.93)
  other vias: 6.35,26.67
N$63  (via drill 1.1 pad 1.93)
  other vias: 6.35,24.13
N$64  (via drill 1.1 pad 1.93)
  other vias: 16.51,11.43
N$65  (via drill 1.1 pad 1.93)
  other vias: 16.51,13.97
N$66  (via drill 1.1 pad 1.93)
  other vias: 16.51,16.51
N$67  (via drill 1.1 pad 1.93)
  other vias: 16.51,19.05
N$68  (via drill 1.1 pad 1.93)
  other vias: 16.51,21.59
N$69  (via drill 1.1 pad 1.93)
  other vias: 19.05,21.59
N$70  (via drill 1.1 pad 1.93)
  other vias: 19.05,19.05
N$71  (via drill 1.1 pad 1.93)
  other vias: 19.05,16.51
N$72  (via drill 1.1 pad 1.93)
  other vias: 19.05,13.97
N$73  (via drill 1.1 pad 1.93)
  other vias: 19.05,11.43
N$74  (via drill 1.1 pad 1.93)
  other vias: 21.59,11.43
N$75  (via drill 1.1 pad 1.93)
  other vias: 21.59,13.97
N$76  (via drill 1.1 pad 1.93)
  other vias: 21.59,16.51
N$77  (via drill 1.1 pad 1.93)
  other vias: 21.59,19.05
N$78  (via drill 1.1 pad 1.93)
  other vias: 21.59,21.59
N$79  (via drill 1.1 pad 1.93)
  other vias: 24.13,21.59
N$80  (via drill 1.1 pad 1.93)
  other vias: 24.13,19.05
N$81  (via drill 1.1 pad 1.93)
  other vias: 24.13,16.51
N$82  (via drill 1.1 pad 1.93)
  other vias: 24.13,13.97
N$83  (via drill 1.1 pad 1.93)
  other vias: 24.13,11.43
N$84  (via drill 1.1 pad 1.93)
  other vias: 26.67,11.43
N$85  (via drill 1.1 pad 1.93)
  other vias: 26.67,13.97
N$86  (via drill 1.1 pad 1.93)
  other vias: 26.67,16.51
N$87  (via drill 1.1 pad 1.93)
  other vias: 26.67,19.05
N$88  (via drill 1.1 pad 1.93)
  other vias: 26.67,21.59
N$89  (via drill 1.1 pad 1.93)
  other vias: 29.21,21.59
N$90  (via drill 1.1 pad 1.93)
  other vias: 29.21,19.05
N$91  (via drill 1.1 pad 1.93)
  other vias: 29.21,16.51
N$92  (via drill 1.1 pad 1.93)
  other vias: 29.21,13.97
N$93  (via drill 1.1 pad 1.93)
  other vias: 29.21,11.43
N$94  (via drill 1.1 pad 1.93)
  other vias: 31.75,11.43
N$95  (via drill 1.1 pad 1.93)
  other vias: 34.29,11.43
N$96  (via drill 1.1 pad 1.93)
  other vias: 36.83,11.43
N$97  (via drill 1.1 pad 1.93)
  other vias: 39.37,11.43
N$98  (via drill 1.1 pad 1.93)
  other vias: 41.91,11.43
N$99  (via drill 1.1 pad 1.93)
  other vias: 41.91,13.97
N$100  (via drill 1.1 pad 1.93)
  other vias: 41.91,16.51
N$101  (via drill 1.1 pad 1.93)
  other vias: 41.91,19.05
N$102  (via drill 1.1 pad 1.93)
  other vias: 41.91,21.59
N$103  (via drill 1.1 pad 1.93)
  other vias: 39.37,21.59
N$104  (via drill 1.1 pad 1.93)
  other vias: 39.37,19.05
N$105  (via drill 1.1 pad 1.93)
  other vias: 39.37,16.51
N$106  (via drill 1.1 pad 1.93)
  other vias: 39.37,13.97
N$107  (via drill 1.1 pad 1.93)
  other vias: 36.83,13.97
N$108  (via drill 1.1 pad 1.93)
  other vias: 36.83,16.51
N$109  (via drill 1.1 pad 1.93)
  other vias: 36.83,19.05
N$110  (via drill 1.1 pad 1.93)
  other vias: 36.83,21.59
N$111  (via drill 1.1 pad 1.93)
  other vias: 34.29,21.59
N$112  (via drill 1.1 pad 1.93)
  other vias: 34.29,19.05
N$113  (via drill 1.1 pad 1.93)
  other vias: 34.29,16.51
N$114  (via drill 1.1 pad 1.93)
  other vias: 34.29,13.97
N$115  (via drill 1.1 pad 1.93)
  other vias: 31.75,13.97
N$116  (via drill 1.1 pad 1.93)
  other vias: 31.75,16.51
N$117  (via drill 1.1 pad 1.93)
  other vias: 31.75,19.05
N$118  (via drill 1.1 pad 1.93)
  other vias: 31.75,21.59
N$119  (via drill 1.1 pad 1.93)
  other vias: 44.45,21.59
N$120  (via drill 1.1 pad 1.93)
  other vias: 44.45,19.05
N$121  (via drill 1.1 pad 1.93)
  other vias: 44.45,16.51
N$122  (via drill 1.1 pad 1.93)
  other vias: 44.45,13.97
N$123  (via drill 1.1 pad 1.93)
  other vias: 44.45,11.43
N$124  (via drill 1.1 pad 1.93)
  other vias: 46.99,11.43
N$125  (via drill 1.1 pad 1.93)
  other vias: 49.53,11.43
N$126  (via drill 1.1 pad 1.93)
  other vias: 49.53,13.97
N$127  (via drill 1.1 pad 1.93)
  other vias: 46.99,13.97
N$128  (via drill 1.1 pad 1.93)
  other vias: 46.99,16.51
N$129  (via drill 1.1 pad 1.93)
  other vias: 49.53,16.51
N$130  (via drill 1.1 pad 1.93)
  other vias: 49.53,19.05
N$131  (via drill 1.1 pad 1.93)
  other vias: 46.99,19.05
N$132  (via drill 1.1 pad 1.93)
  other vias: 46.99,21.59
N$133  (via drill 1.1 pad 1.93)
  other vias: 49.53,21.59
N$134  (via drill 1.1 pad 1.93)
  other vias: 101.6,21.59
N$135  (via drill 1.1 pad 1.93)
  other vias: 101.6,19.05
N$136  (via drill 1.1 pad 1.93)
  other vias: 101.6,16.51
N$137  (via drill 1.1 pad 1.93)
  other vias: 101.6,13.97
N$138  (via drill 1.1 pad 1.93)
  other vias: 101.6,11.43
N$139  (via drill 1.1 pad 1.93)
  other vias: 91.44,11.43
N$140  (via drill 1.1 pad 1.93)
  other vias: 91.44,13.97
N$141  (via drill 1.1 pad 1.93)
  other vias: 91.44,16.51
N$142  (via drill 1.1 pad 1.93)
  other vias: 91.44,19.05
N$143  (via drill 1.1 pad 1.93)
  other vias: 91.44,21.59
N$144  (via drill 1.1 pad 1.93)
  other vias: 88.9,21.59
N$145  (via drill 1.1 pad 1.93)
  other vias: 88.9,19.05
N$146  (via drill 1.1 pad 1.93)
  other vias: 88.9,16.51
N$147  (via drill 1.1 pad 1.93)
  other vias: 88.9,13.97
N$148  (via drill 1.1 pad 1.93)
  other vias: 88.9,11.43
N$149  (via drill 1.1 pad 1.93)
  other vias: 86.36,11.43
N$150  (via drill 1.1 pad 1.93)
  other vias: 86.36,13.97
N$151  (via drill 1.1 pad 1.93)
  other vias: 86.36,16.51
N$152  (via drill 1.1 pad 1.93)
  other vias: 86.36,19.05
N$153  (via drill 1.1 pad 1.93)
  other vias: 86.36,21.59
N$154  (via drill 1.1 pad 1.93)
  other vias: 83.82,21.59
N$155  (via drill 1.1 pad 1.93)
  other vias: 83.82,19.05
N$156  (via drill 1.1 pad 1.93)
  other vias: 83.82,16.51
N$157  (via drill 1.1 pad 1.93)
  other vias: 83.82,13.97
N$158  (via drill 1.1 pad 1.93)
  other vias: 83.82,11.43
N$159  (via drill 1.1 pad 1.93)
  other vias: 81.28,11.43
N$160  (via drill 1.1 pad 1.93)
  other vias: 81.28,13.97
N$161  (via drill 1.1 pad 1.93)
  other vias: 81.28,16.51
N$162  (via drill 1.1 pad 1.93)
  other vias: 81.28,19.05
N$163  (via drill 1.1 pad 1.93)
  other vias: 81.28,21.59
N$164  (via drill 1.1 pad 1.93)
  other vias: 78.74,21.59
N$165  (via drill 1.1 pad 1.93)
  other vias: 78.74,19.05
N$166  (via drill 1.1 pad 1.93)
  other vias: 78.74,16.51
N$167  (via drill 1.1 pad 1.93)
  other vias: 78.74,13.97
N$168  (via drill 1.1 pad 1.93)
  other vias: 78.74,11.43
N$169  (via drill 1.1 pad 1.93)
  other vias: 76.2,11.43
N$170  (via drill 1.1 pad 1.93)
  other vias: 76.2,13.97
N$171  (via drill 1.1 pad 1.93)
  other vias: 76.2,16.51
N$172  (via drill 1.1 pad 1.93)
  other vias: 76.2,19.05
N$173  (via drill 1.1 pad 1.93)
  other vias: 76.2,21.59
N$174  (via drill 1.1 pad 1.93)
  other vias: 73.66,21.59
N$175  (via drill 1.1 pad 1.93)
  other vias: 73.66,19.05
N$176  (via drill 1.1 pad 1.93)
  other vias: 73.66,16.51
N$177  (via drill 1.1 pad 1.93)
  other vias: 73.66,13.97
N$178  (via drill 1.1 pad 1.93)
  other vias: 73.66,11.43
N$179  (via drill 1.1 pad 1.93)
  other vias: 71.12,11.43
N$180  (via drill 1.1 pad 1.93)
  other vias: 71.12,13.97
N$181  (via drill 1.1 pad 1.93)
  other vias: 71.12,16.51
N$182  (via drill 1.1 pad 1.93)
  other vias: 71.12,19.05
N$183  (via drill 1.1 pad 1.93)
  other vias: 71.12,21.59
N$184  (via drill 1.1 pad 1.93)
  other vias: 68.58,21.59
N$185  (via drill 1.1 pad 1.93)
  other vias: 68.58,19.05
N$186  (via drill 1.1 pad 1.93)
  other vias: 68.58,16.51
N$187  (via drill 1.1 pad 1.93)
  other vias: 68.58,13.97
N$188  (via drill 1.1 pad 1.93)
  other vias: 68.58,11.43
N$189  (via drill 1.1 pad 1.93)
  other vias: 63.5,11.43
N$190  (via drill 1.1 pad 1.93)
  other vias: 63.5,13.97
N$191  (via drill 1.1 pad 1.93)
  other vias: 63.5,16.51
N$192  (via drill 1.1 pad 1.93)
  other vias: 63.5,19.05
N$193  (via drill 1.1 pad 1.93)
  other vias: 63.5,21.59
N$194  (via drill 1.1 pad 1.93)
  other vias: 63.5,24.13
N$195  (via drill 1.1 pad 1.93)
  other vias: 63.5,26.67
N$196  (via drill 1.1 pad 1.93)
  other vias: 58.42,11.43
N$197  (via drill 1.1 pad 1.93)
  other vias: 58.42,13.97
N$198  (via drill 1.1 pad 1.93)
  other vias: 58.42,16.51
N$199  (via drill 1.1 pad 1.93)
  other vias: 58.42,19.05
N$200  (via drill 1.1 pad 1.93)
  other vias: 58.42,21.59
N$201  (via drill 1.1 pad 1.93)
  other vias: 58.42,24.13
N$202  (via drill 1.1 pad 1.93)
  other vias: 58.42,26.67
N$203  (via drill 1.1 pad 1.93)
  other vias: 55.88,21.59
N$204  (via drill 1.1 pad 1.93)
  other vias: 53.34,21.59
N$205  (via drill 1.1 pad 1.93)
  other vias: 53.34,19.05
N$206  (via drill 1.1 pad 1.93)
  other vias: 55.88,19.05
N$207  (via drill 1.1 pad 1.93)
  other vias: 55.88,16.51
N$208  (via drill 1.1 pad 1.93)
  other vias: 53.34,16.51
N$209  (via drill 1.1 pad 1.93)
  other vias: 53.34,13.97
N$210  (via drill 1.1 pad 1.93)
  other vias: 55.88,13.97
N$211  (via drill 1.1 pad 1.93)
  other vias: 55.88,11.43
N$212  (via drill 1.1 pad 1.93)
  other vias: 53.34,11.43
USB
  Top 0.25: MS1.26 21.56,26.62 20.62,26.62 19.5,25.5 16.12,25.5 15.19,24.56 15.19,23.62 15.94,22.88 17.06,22.88 17.81,22.12 17.81,18.56 18.56,17.81 66.56,17.81 67.31,18.56 67.31,22.12 68.06,22.88 72.38,22.88 73.5,24 JP4.3
  Bottom 0.25: JP1.3 MS1.26 | MS1.26 21.59,26.81 | 21.59,26.81 J1.3 | JP4.3 MS2.26 | MS2.26 73.66,26.81 | 73.66,26.81 J2.3 | MS1.26 21.56,26.81 21.59,26.81 | MS2.26 73.69,26.81 73.66,26.81
VBAT
  Top 0.25: JP1.1 16.69,24 17.44,24 18.56,22.88 67.31,22.88 68.44,24 JP4.1
  Bottom 0.25: JP1.1 MS1.28 | MS1.28 16.51,26.81 | 16.51,26.81 J1.1 | JP4.1 MS2.28 | MS2.28 68.58,26.81 | 68.58,26.81 J2.1 | MS1.28 16.5,26.81 16.51,26.81 | MS2.28 68.62,26.81 68.58,26.81

### Text on the board
tPlace: 1X12 | BAT | En | USB | SCL | SDA | 1X12 | BAT | En | USB | SCL | SDA | Top | FeatherWing / Doubler 1X2 | A | B | 1X16 | 1X16 | RST | 3V0 | GND | SCK | SDO | SDI | RX | TX | RST | 3V0 | GND | SCK | SDO | SDI | RX | TX | v1.0
bPlace: Bottom | MAE_2022_v1.0 / Build_21012022 | FeatherWing_1X2_PCB